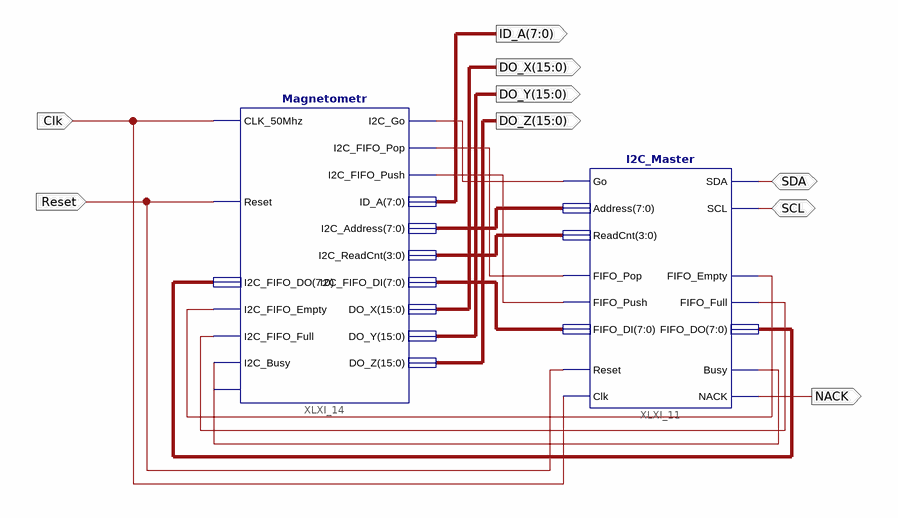
[diagram p0: schematic sheet 1]
// Xilinx ISE schematic MagnetoSchematic.sch (spartan3e) as structural Verilog: 2 symbols, 9 ports
module MagnetoSchematic (
  input  Reset,
  input  Clk,
  inout  SDA,
  inout  SCL,
  output NACK,
  output [7:0] ID_A,
  output [15:0] DO_X,
  output [15:0] DO_Y,
  output [15:0] DO_Z
);

  wire XLXN_45, XLXN_48, XLXN_49, XLXN_59, XLXN_60, XLXN_61;
  wire [3:0] XLXN_47;
  wire [7:0] XLXN_46, XLXN_57, XLXN_58;

  I2C_Master XLXI_11 (
    .Go(XLXN_45), .Address(XLXN_46), .ReadCnt(XLXN_47), .SDA(SDA), .SCL(SCL), .FIFO_Pop(XLXN_48),
    .FIFO_Push(XLXN_49), .FIFO_DI(XLXN_58), .FIFO_Empty(XLXN_61), .FIFO_Full(XLXN_60), .FIFO_DO(XLXN_57),
    .Reset(Reset), .Clk(Clk), .Busy(XLXN_59), .NACK(NACK));
  Magnetometr XLXI_14 (
    .CLK_50Mhz(Clk), .Reset(Reset), .I2C_FIFO_Empty(XLXN_61), .I2C_FIFO_Full(XLXN_60), .I2C_Busy(XLXN_59),
    .I2C_FIFO_DO(XLXN_57), .I2C_Go(XLXN_45), .I2C_FIFO_Pop(XLXN_48), .I2C_FIFO_Push(XLXN_49), .ID_A(ID_A),
    .DO_X(DO_X), .DO_Y(DO_Y), .DO_Z(DO_Z), .I2C_Address(XLXN_46), .I2C_ReadCnt(XLXN_47), .I2C_FIFO_DI(XLXN_58));  // open: DRDY
endmodule
